# Altium project RFSoC-AMC.PrjPCB (part 20 of 22)

## Sheet FPGA_7A35T_POWER.SchDoc: RFSoC AMC
size 420 x 297 mm; CmpIndex: 0; CompanyName: WUT; DrawnBy: T. Przywozki; Organization: WUT ISE; Address1: Warsaw University of Technology; Address2: Nowowiejska 15/19 00-665 Warsaw; Address3: Tomasz.Przywozki@pw.edu.pl; DocumentNumber: 17; Revision: 1; SheetNumber: 17; SheetTotal: 45; Project: RFSoC AMC; ModifiedBy: T. Przywozki; CreateDate: -; CheckedDate: -; DivGrp: ISE; Designer: T. Przywozki; ModifiedDate: -; ProjectName: ADC/DAC MEZZANINE
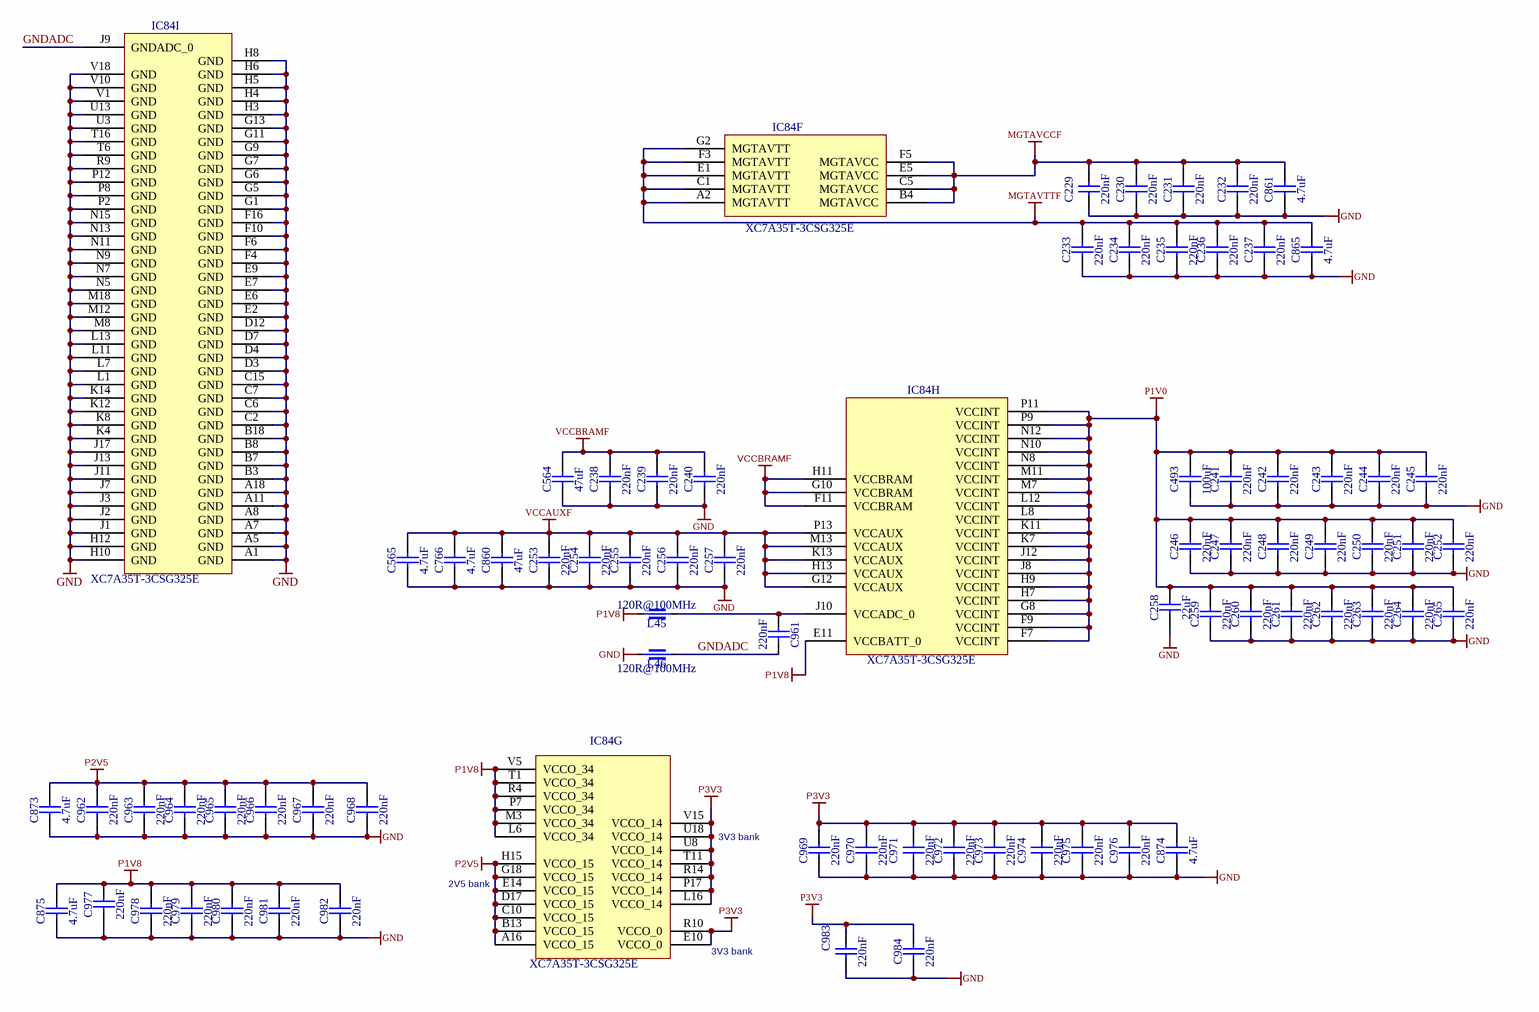
[diagram p43: FPGA_7A35T_POWER.SchDoc]

### Parts
C229  220nF  [CAPC0603X33N]
C230  220nF  [CAPC0603X33N]
C231  220nF  [CAPC0603X33N]
C232  220nF  [CAPC0603X33N]
C233  220nF  [CAPC0603X33N]
C234  220nF  [CAPC0603X33N]
C235  220nF  [CAPC0603X33N]
C236  220nF  [CAPC0603X33N]
C237  220nF  [CAPC0603X33N]
C238  220nF  [CAPC0603X33N]
C239  220nF  [CAPC0603X33N]
C240  220nF  [CAPC0603X33N]
C241  220nF  [CAPC0603X33N]
C242  220nF  [CAPC0603X33N]
C243  220nF  [CAPC0603X33N]
C244  220nF  [CAPC0603X33N]
C245  220nF  [CAPC0603X33N]
C246  220nF  [CAPC0603X33N]
C247  220nF  [CAPC0603X33N]
C248  220nF  [CAPC0603X33N]
C249  220nF  [CAPC0603X33N]
C250  220nF  [CAPC0603X33N]
C251  220nF  [CAPC0603X33N]
C252  220nF  [CAPC0603X33N]
C253  220nF  [CAPC0603X33N]
C254  220nF  [CAPC0603X33N]
C255  220nF  [CAPC0603X33N]
C256  220nF  [CAPC0603X33N]
C257  220nF  [CAPC0603X33N]
C258  22uF  [CAPC2012X135N]
C259  220nF  [CAPC0603X33N]
C260  220nF  [CAPC0603X33N]
C261  220nF  [CAPC0603X33N]
C262  220nF  [CAPC0603X33N]
C263  220nF  [CAPC0603X33N]
C264  220nF  [CAPC0603X33N]
C265  220nF  [CAPC0603X33N]
C493  100uF  [CAPC3225X270N]
C564  47uF  [CAPC1608X100N]
C565  4.7uF  [CAPC1005X55N]
C766  4.7uF  [CAPC1005X55N]
C860  47uF  [CAPC1608X100N]
C861  4.7uF  [CAPC1005X55N]
C865  4.7uF  [CAPC1005X55N]
C873  4.7uF  [CAPC1005X55N]
C874  4.7uF  [CAPC1005X55N]
C875  4.7uF  [CAPC1005X55N]
C961  220nF  [CAPC0603X33N]
C962  220nF  [CAPC0603X33N]
C963  220nF  [CAPC0603X33N]
C964  220nF  [CAPC0603X33N]
C965  220nF  [CAPC0603X33N]
C966  220nF  [CAPC0603X33N]
C967  220nF  [CAPC0603X33N]
C968  220nF  [CAPC0603X33N]
C969  220nF  [CAPC0603X33N]
C970  220nF  [CAPC0603X33N]
C971  220nF  [CAPC0603X33N]
C972  220nF  [CAPC0603X33N]
C973  220nF  [CAPC0603X33N]
C974  220nF  [CAPC0603X33N]
C975  220nF  [CAPC0603X33N]
C976  220nF  [CAPC0603X33N]
C977  220nF  [CAPC0603X33N]
C978  220nF  [CAPC0603X33N]
C979  220nF  [CAPC0603X33N]
C980  220nF  [CAPC0603X33N]
C981  220nF  [CAPC0603X33N]
C982  220nF  [CAPC0603X33N]
C983  220nF  [CAPC0603X33N]
C984  220nF  [CAPC0603X33N]
IC84  XC7A35T-3CSG325E  [CSG325]  (parts F,G,H,I of 9)
L45  120R@100MHz  [INDC1005X55N]
L46  120R@100MHz  [INDC1005X55N]

### Nets
GND: C229.1 C230.1 C231.1 C232.1 C233.1 C234.1 C235.1 C236.1 C237.1 C238.1 C239.1 C240.1 C241.1 C242.1 C243.1 C244.1 C245.1 C246.1 C247.1 C248.1 C249.1 C250.1 C251.1 C252.1 C253.1 C254.1 C255.1 C256.1 C257.1 C258.1 C259.1 C260.1 C261.1 C262.1 C263.1 C264.1 C265.1 C493.1 C564.1 C565.1 C766.1 C860.1 C861.1 C865.1 C873.1 C874.1 C875.1 C962.1 C963.1 C964.1 C965.1 C966.1 C967.1 C968.1 C969.1 C970.1 C971.1 C972.1 C973.1 C974.1 C975.1 C976.1 C977.1 C978.1 C979.1 C980.1 C981.1 C982.1 C983.1 C984.1 IC84.A1(GND) IC84.A5(GND) IC84.A7(GND) IC84.A8(GND) IC84.A11(GND) IC84.A18(GND) IC84.B3(GND) IC84.B7(GND) IC84.B8(GND) IC84.B18(GND) IC84.C2(GND) IC84.C6(GND) IC84.C7(GND) IC84.C15(GND) IC84.D3(GND) IC84.D4(GND) IC84.D7(GND) IC84.D12(GND) IC84.E2(GND) IC84.E6(GND) IC84.E7(GND) IC84.E9(GND) IC84.F4(GND) IC84.F6(GND) IC84.F10(GND) IC84.F16(GND) IC84.G1(GND) IC84.G5(GND) IC84.G6(GND) IC84.G7(GND) IC84.G9(GND) IC84.G11(GND) IC84.G13(GND) IC84.H3(GND) IC84.H4(GND) IC84.H5(GND) IC84.H6(GND) IC84.H8(GND) IC84.H10(GND) IC84.H12(GND) IC84.J1(GND) IC84.J2(GND) IC84.J3(GND) IC84.J7(GND) IC84.J11(GND) IC84.J13(GND) IC84.J17(GND) IC84.K4(GND) IC84.K8(GND) IC84.K12(GND) IC84.K14(GND) IC84.L1(GND) IC84.L7(GND) IC84.L11(GND) IC84.L13(GND) IC84.M8(GND) IC84.M12(GND) IC84.M18(GND) IC84.N5(GND) IC84.N7(GND) IC84.N9(GND) IC84.N11(GND) IC84.N13(GND) IC84.N15(GND) IC84.P2(GND) IC84.P8(GND) IC84.P12(GND) IC84.R9(GND) IC84.T6(GND) IC84.T16(GND) IC84.U3(GND) IC84.U13(GND) IC84.V1(GND) IC84.V10(GND) IC84.V18(GND) L46.1
MGTAVCCF: C229.2 C230.2 C231.2 C232.2 C861.2 IC84.B4(MGTAVCC) IC84.C5(MGTAVCC) IC84.E5(MGTAVCC) IC84.F5(MGTAVCC)
MGTAVTTF: C233.2 C234.2 C235.2 C236.2 C237.2 C865.2 IC84.A2(MGTAVTT) IC84.C1(MGTAVTT) IC84.E1(MGTAVTT) IC84.F3(MGTAVTT) IC84.G2(MGTAVTT)
P1V0: C241.2 C242.2 C243.2 C244.2 C245.2 C246.2 C247.2 C248.2 C249.2 C250.2 C251.2 C252.2 C258.2 C259.2 C260.2 C261.2 C262.2 C263.2 C264.2 C265.2 C493.2 IC84.F7(VCCINT) IC84.F9(VCCINT) IC84.G8(VCCINT) IC84.H7(VCCINT) IC84.H9(VCCINT) IC84.J8(VCCINT) IC84.J12(VCCINT) IC84.K7(VCCINT) IC84.K11(VCCINT) IC84.L8(VCCINT) IC84.L12(VCCINT) IC84.M7(VCCINT) IC84.M11(VCCINT) IC84.N8(VCCINT) IC84.N10(VCCINT) IC84.N12(VCCINT) IC84.P9(VCCINT) IC84.P11(VCCINT)
P1V8: C875.2 C977.2 C978.2 C979.2 C980.2 C981.2 C982.2 IC84.E11(VCCBATT_0) IC84.L6(VCCO_34) IC84.M3(VCCO_34) IC84.P7(VCCO_34) IC84.R4(VCCO_34) IC84.T1(VCCO_34) IC84.V5(VCCO_34) L45.1
P2V5: C873.2 C962.2 C963.2 C964.2 C965.2 C966.2 C967.2 C968.2 IC84.A16(VCCO_15) IC84.B13(VCCO_15) IC84.C10(VCCO_15) IC84.D17(VCCO_15) IC84.E14(VCCO_15) IC84.G18(VCCO_15) IC84.H15(VCCO_15)
P3V3: C874.2 C969.2 C970.2 C971.2 C972.2 C973.2 C974.2 C975.2 C976.2 C983.2 C984.2 IC84.E10(VCCO_0) IC84.L16(VCCO_14) IC84.P17(VCCO_14) IC84.R10(VCCO_0) IC84.R14(VCCO_14) IC84.T11(VCCO_14) IC84.U8(VCCO_14) IC84.U18(VCCO_14) IC84.V15(VCCO_14)
VCCAUXF: C253.2 C254.2 C255.2 C256.2 C257.2 C565.2 C766.2 C860.2 IC84.G12(VCCAUX) IC84.H13(VCCAUX) IC84.K13(VCCAUX) IC84.M13(VCCAUX) IC84.P13(VCCAUX)
VCCBRAMF: C238.2 C239.2 C240.2 C564.2 IC84.F11(VCCBRAM) IC84.G10(VCCBRAM) IC84.H11(VCCBRAM)
GNDADC: C961.2 IC84.J9(GNDADC_0) L46.2
NetC961_1: C961.1 IC84.J10(VCCADC_0) L45.2

### Notes on the sheet
- 3V3 bank
- (near IC84) 2V5 bank
- (near IC84) 3V3 bank
- Project/Equipment
- Document
- Designer
- Drawn by
- Check.by
- Copyright WUT ISE 2021
  This documentation describes Open Hardware and is licensed under CERN OHL v.1.1. You may redistribute and modify this documentaction under the terms of the CERN OHL v1.1.
  (http://ohwr.org/CERNOHL). This documentation is dristributed WITHOUT ANY EXPRESS OR IMPLIED WARRANTY, INCLUDING OF MERCHANTABLITY, SATISFACTORY QUALITY AND FITNESS FOR A PARTICULAR PURPOSE. Please see the CERN OHL v.1.1 for applicable conditions
- File
- Last Mod.
- Print Date
- Sheet
- Size
- A3
- of
- Rev
- Contact:

### Library data of the parts
C229-C257 C259-C265 C961-C984 = CC0201_220NF_6.3V_20%_X5R: Non-polarised capacitor; Manufacturer: GENERIC; Manufacturer1 Part Number: JMK063BJ224MP-F; Part Description: SMD Multilayer Chip Ceramic Capacitor; TC: X5R; Tolerance: ±20%; Voltage: 6.3V; Case: 0201; Manufacturer Part Number: CC0201_220NF_6.3V_20%_X5R; Manufacturer1 Example: TAIYO YUDEN; Part Number: CC0201_220NF_6.3V_20%_X5R; Pin Count: 2; SMD: Yes; Status: Not Recommended; Value: 220nF; Component Kind: Standard; Component Type: Standard; Mounted: Yes; Socket: No; Sense: No; Manufacturer1 ComponentHeight: 0.33mm; HelpURL: \\cern.ch\dfs\Applications\Altium\Datasheets\CC0201_X5R_TAIYO-YUDEN_STANDARD-CLASS2.pdf; Author: CERN DEM JLC; CreateDate: 27.05.2010; LatestRevisionDate: 27.05.2010
C258 = CC0805_22UF_6.3V_20%_X5R: Non-polarised capacitor; Manufacturer: GENERIC; Manufacturer1 Part Number: C0805C226M9PAC7800; Part Description: SMD Multilayer Chip Ceramic Capacitor; TC: X5R; Tolerance: ±20%; Voltage: 6.3V; Case: 0805; Manufacturer Part Number: CC0805_22UF_6.3V_20%_X5R; Manufacturer1 Example: KEMET; Part Number: CC0805_22UF_6.3V_20%_X5R; Pin Count: 2; SMD: Yes; Status: Preferred; Value: 22uF; Component Kind: Standard; Component Type: Standard; Mounted: Yes; Socket: No; Sense: No; Manufacturer1 ComponentHeight: 1.45mm; HelpURL: \\cern.ch\dfs\Applications\Altium\Datasheets\CC1206_X5R_KEMET.pdf; Author: CERN DEM JLC; CreateDate: 03.12.2007; LatestRevisionDate: 03.12.2007
C493 = CC1210_100UF_6.3V_20%_X5R: Non-polarised capacitor; Part Description: SMD Multilayer Chip Ceramic Capacitor; Manufacturer: GENERIC; Manufacturer1 Part Number: GRM32ER60J107ME20L; Voltage: 6.3V; Tolerance: ±20%; TC: X5R; Part Number: CC1210_100UF_6.3V_20%_X5R; Component Kind: Standard; Component Type: Standard; Pin Count: 2; Value: 100uF; Status: Preferred; Manufacturer Part Number: CC1210_100UF_6.3V_20%_X5R; Case: 1210; Mounted: Yes; Socket: No; SMD: Yes; Sense: No; Manufacturer1 Example: MURATA; Manufacturer1 ComponentHeight: 2.7mm; HelpURL: \\cern.ch\dfs\Applications\Altium\Datasheets\CC1210_X5R_MURATA.pdf; Author: CERN DEM JLC; CreateDate: 19.04.2010; LatestRevisionDate: 19.04.2010
C564 C860 = CC0603_47UF_6.3V_20%_X5R: Non-polarised capacitor; Part Description: SMD Multilayer Chip Ceramic Capacitor; Manufacturer: GENERIC; Manufacturer1 Part Number: GRM188R60J476ME15D; Voltage: 6.3V; Tolerance: ±20%; TC: X5R; Part Number: CC0603_47UF_6.3V_20%_X5R; Component Kind: Standard; Component Type: Standard; Pin Count: 2; Value: 47uF; Status: None; Manufacturer Part Number: CC0603_47UF_6.3V_20%_X5R; Case: 0603; Mounted: Yes; Socket: No; SMD: Yes; Sense: No; Manufacturer1 Example: MURATA; Manufacturer1 ComponentHeight: 1mm; HelpURL: \\cern.ch\dfs\Applications\Altium\Datasheets\CC0603_MURATA_GRM188R60J476ME15D.pdf; Author: CERN DEM JLC; CreateDate: 01.02.2018; LatestRevisionDate: 01.02.2018
C565 C766 C861 C865 C873-C875 = CC0402_4.7UF_6.3V_20%_X5R: Non-polarised capacitor; Part Description: SMD Multilayer Chip Ceramic Capacitor; Manufacturer: GENERIC; Manufacturer1 Part Number: C1005X5R0J475M050BC; Voltage: 6.3V; Tolerance: ±20%; TC: X5R; Part Number: CC0402_4.7UF_6.3V_20%_X5R; Component Kind: Standard; Component Type: Standard; Pin Count: 2; Value: 4.7uF; Status: Preferred; Manufacturer Part Number: CC0402_4.7UF_6.3V_20%_X5R; Case: 0402; Mounted: Yes; Socket: No; SMD: Yes; Sense: No; Manufacturer1 Example: TDK; Manufacturer1 ComponentHeight: 0.65mm; HelpURL: \\cern.ch\dfs\Applications\Altium\Datasheets\CC0402_X5R_TDK_C.pdf; Author: CERN DEM JLC; CreateDate: 03.03.2015; LatestRevisionDate: 03.03.2015
IC84 = CMP-0383-00015-1: Artix-7 FPGA, 150 User I/Os, 4 GTP, 324-Ball BGA, Speed Grade 3, Extended Grade, Pb-Free; Manufacturer: Xilinx; CMTs: 5; Available User I/O: 150; GTP: 4; Speed Grades: 3; Total Block RAM: 1800 Kb; Logic Cells: 33280; ComponentLink3URL: http://www.xilinx.com/support/documentation/user_guides/ug475_7Series_Pkg_Pinout.pdf; ComponentLink3Description: Pinout; Operating Temperature Range: Extended; PackageReference: CSG-325; PackageDescription: 324-Ball Wire-Bond Chip-Scale BGA, Body 15 x 15 mm, Pitch 0.8 mm; ComponentLink4URL: http://www.xilinx.com/support/documentation/user_guides/ug475_7Series_Pkg_Pinout.pdf; ComponentLink1Description: Manufacturer URL; ComponentLink2Description: Datasheet; DatasheetVersion: Rev. 1.15; PartNumber: XC7A35T-3CSG325E; Mounting Technology: Surface Mount; ComponentLink1URL: http://www.xilinx.com/; PackageVersion: Rev. 1.11; ComponentLink2URL: http://www.xilinx.com/support/documentation/data_sheets/ds180_7Series_Overview.pdf; Maximum Distributed RAM: 400 Kb; ComponentLink4Description: Package Specification
L45 L46 = IND0402_MURATA_BLM15PX121SN1D: Manufacturer: MURATA; Part Description: SMD EMIFIL Chip Ferrite Bead; Power: 2A; Resistance: 0.055R; Tolerance: ±25%; Case: 0402; ComponentHeight: 0.55mm; Manufacturer Part Number: BLM15PX121SN1D; Part Number: IND0402_MURATA_BLM15PX121SN1D; Pin Count: 2; SMD: Yes; Value: 120R@100MHz; Component Kind: Standard; Component Type: Standard; Status: None; Mounted: Yes; Socket: No; Sense: No; HelpURL: \\cern.ch\dfs\Applications\Altium\Datasheets\IND0402_MURATA_BLM15PX.pdf; Author: CERN DEM JMW; CreateDate: 19.02.2014; LatestRevisionDate: 25.10.2018

## Sheet SoC_Decoupling.SchDoc: RFSoC AMC
size 420 x 297 mm; CompanyName: WUT; DrawnBy: T. Przywozki; Organization: WUT ISE; Address1: Warsaw University of Technology; Address2: Nowowiejska 15/19 00-665 Warsaw; Address3: Tomasz.Przywozki@pw.edu.pl; DocumentNumber: 42; Revision: 1; SheetNumber: 42; SheetTotal: 45; Project: RFSoC AMC; ModifiedBy: T. Przywozki; CreateDate: -; CheckedDate: -; DivGrp: ISE; Designer: T. Przywozki; ModifiedDate: -; ProjectName: ADC/DAC MEZZANINE
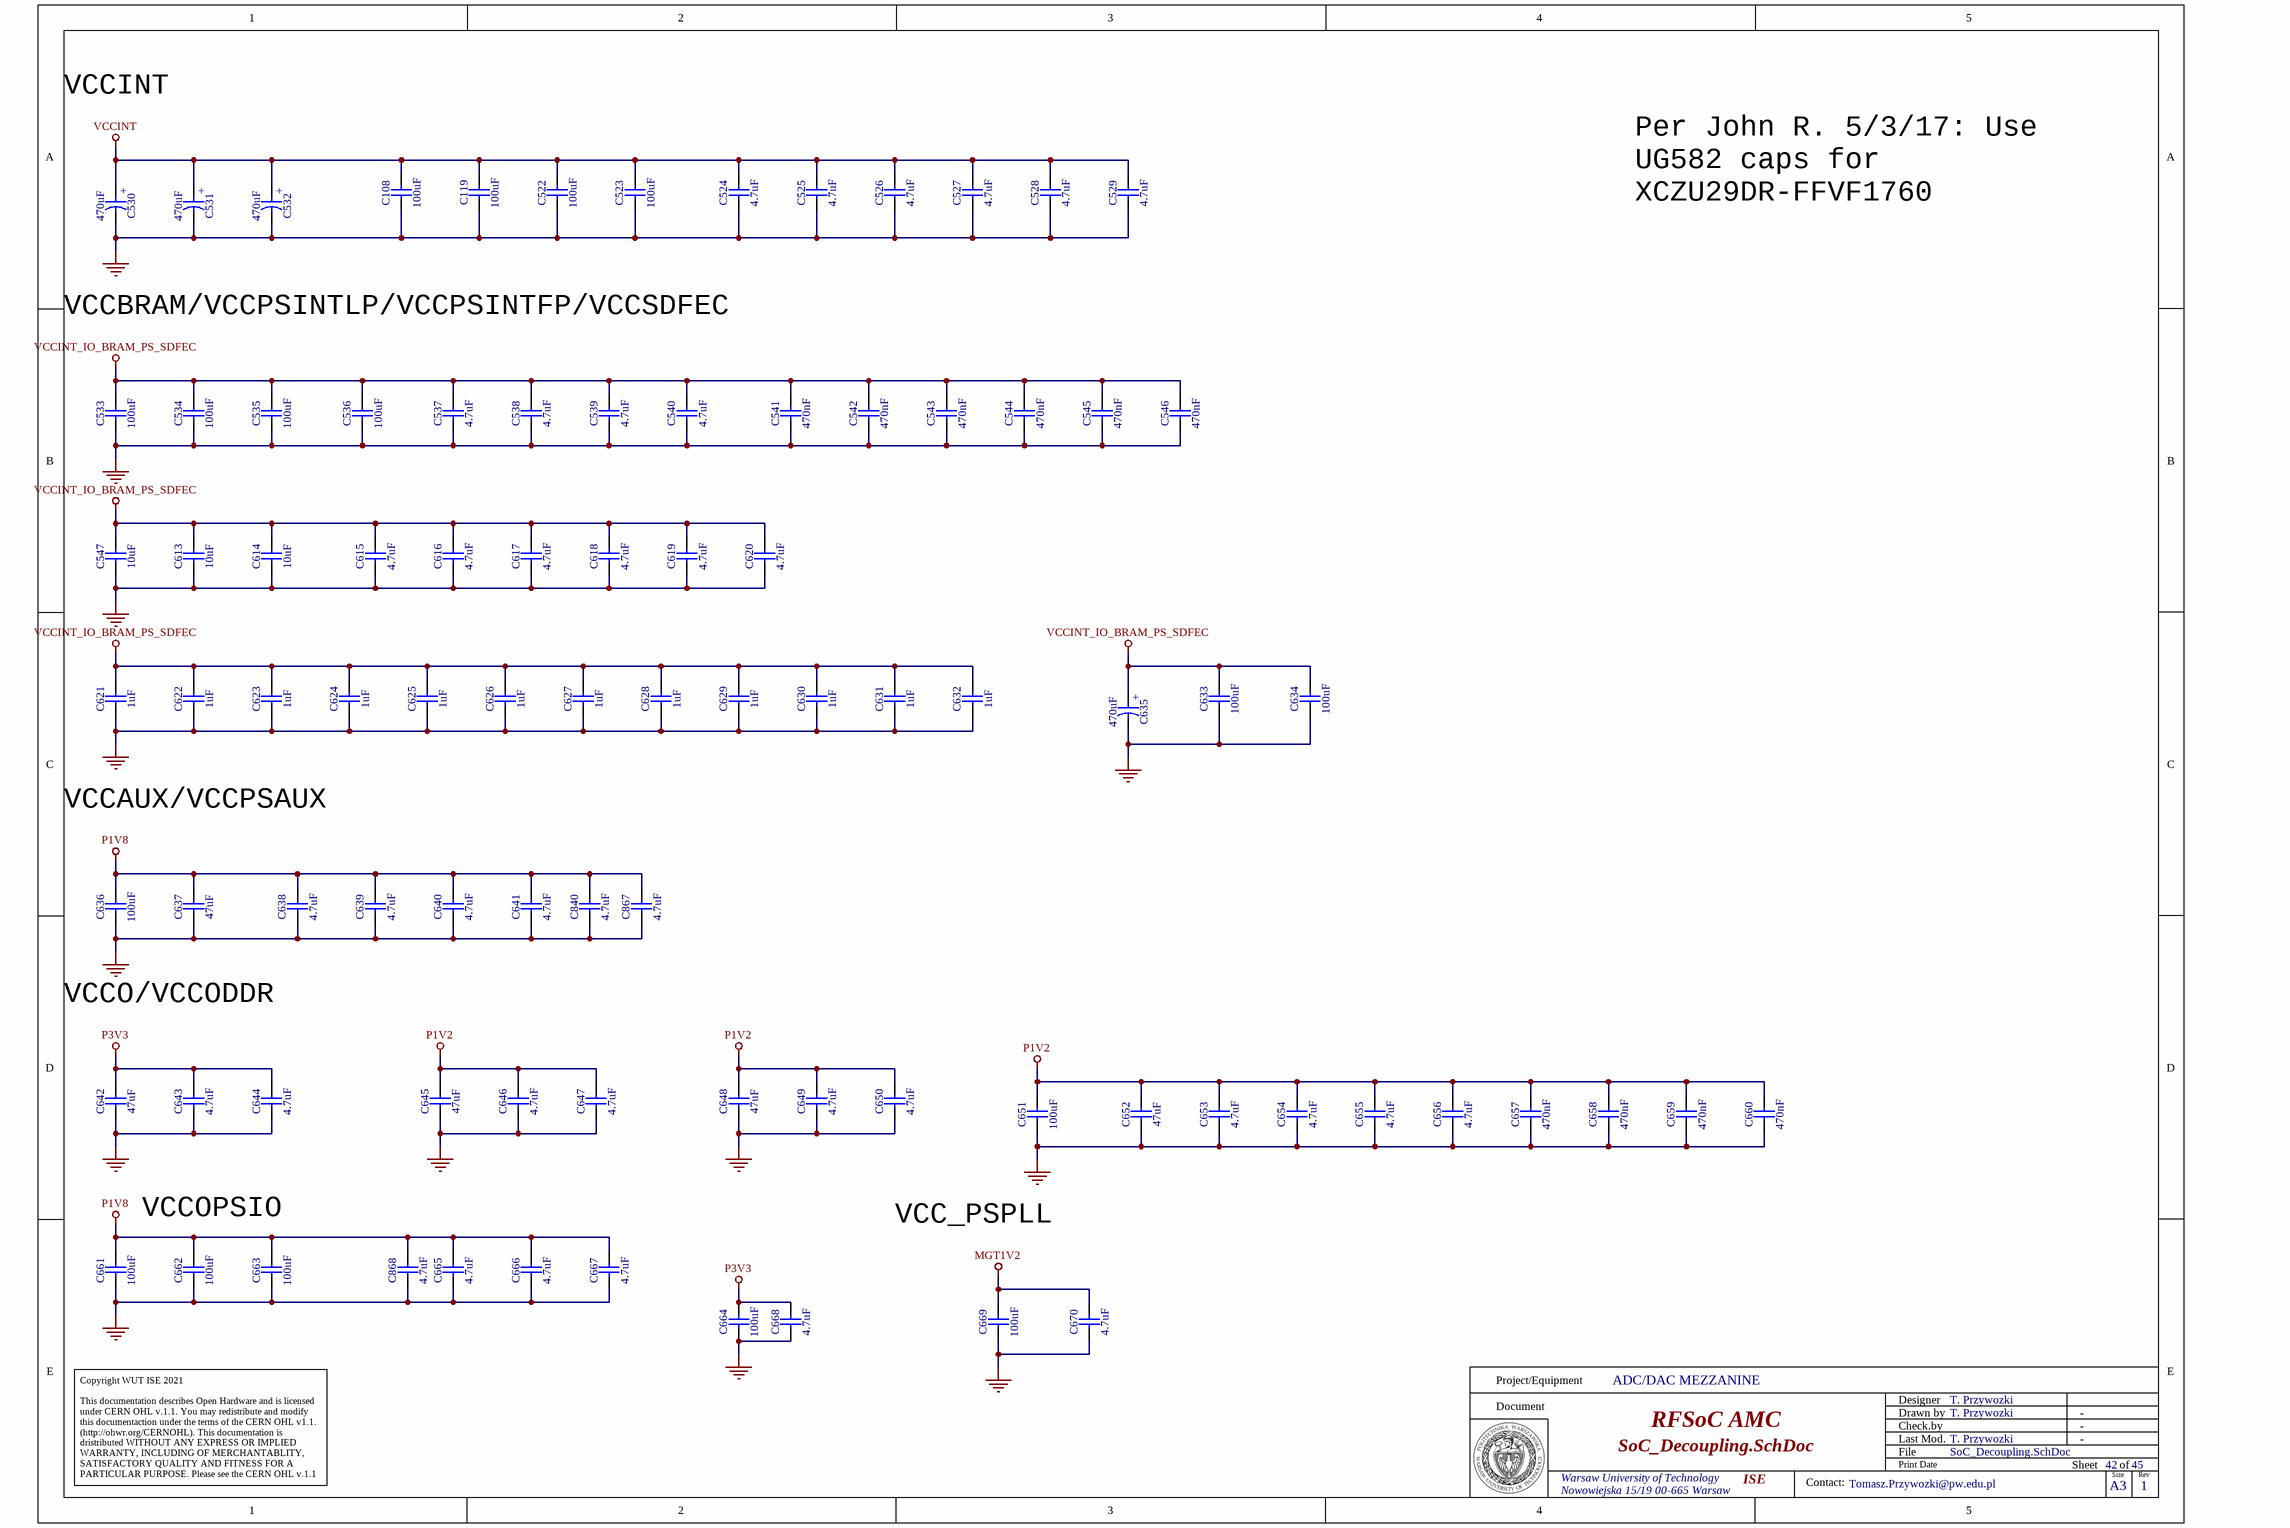
[diagram p44: SoC_Decoupling.SchDoc]

### Parts
C108  100uF  [CAPC3216X180N]
C119  100uF  [CAPC3216X180N]
C522  100uF  [CAPC3216X180N]
C523  100uF  [CAPC3216X180N]
C524  4.7uF  [CAPC1005X55N]
C525  4.7uF  [CAPC1005X55N]
C526  4.7uF  [CAPC1005X55N]
C527  4.7uF  [CAPC1005X55N]
C528  4.7uF  [CAPC1005X55N]
C529  4.7uF  [CAPC1005X55N]
C530  470uF  [CAPMP7343X200N]
C531  470uF  [CAPMP7343X200N]
C532  470uF  [CAPMP7343X200N]
C533  100uF  [CAPC3225X270N]
C534  100uF  [CAPC3225X270N]
C535  100uF  [CAPC3225X270N]
C536  100uF  [CAPC3225X270N]
C537  4.7uF  [CAPC1005X55N]
C538  4.7uF  [CAPC1005X55N]
C539  4.7uF  [CAPC1005X55N]
C540  4.7uF  [CAPC1005X55N]
C541  470nF  [CAPC1005X55N]
C542  470nF  [CAPC1005X55N]
C543  470nF  [CAPC1005X55N]
C544  470nF  [CAPC1005X55N]
C545  470nF  [CAPC1005X55N]
C546  470nF  [CAPC1005X55N]
C547  10uF  [CAPC1608X80N]
C613  10uF  [CAPC1608X80N]
C614  10uF  [CAPC1608X80N]
C615  4.7uF  [CAPC1005X55N]
C616  4.7uF  [CAPC1005X55N]
C617  4.7uF  [CAPC1005X55N]
C618  4.7uF  [CAPC1005X55N]
C619  4.7uF  [CAPC1005X55N]
C620  4.7uF  [CAPC1005X55N]
C621  1uF  [CAPC1005X55N]
C622  1uF  [CAPC1005X55N]
C623  1uF  [CAPC1005X55N]
C624  1uF  [CAPC1005X55N]
C625  1uF  [CAPC1005X55N]
C626  1uF  [CAPC1005X55N]
C627  1uF  [CAPC1005X55N]
C628  1uF  [CAPC1005X55N]
C629  1uF  [CAPC1005X55N]
C630  1uF  [CAPC1005X55N]
C631  1uF  [CAPC1005X55N]
C632  1uF  [CAPC1005X55N]
C633  100uF  [CAPC3225X270N]
C634  100uF  [CAPC3225X270N]
C635  470uF  [CAPMP7343X200N]
C636  100uF  [CAPC3225X270N]
C637  47uF  [CAPC1608X100N]
C638  4.7uF  [CAPC1005X55N]
C639  4.7uF  [CAPC1005X55N]
C640  4.7uF  [CAPC1005X55N]
C641  4.7uF  [CAPC1005X55N]
C642  47uF  [CAPC1608X100N]
C643  4.7uF  [CAPC1005X55N]
C644  4.7uF  [CAPC1005X55N]
C645  47uF  [CAPC1608X100N]
C646  4.7uF  [CAPC1005X55N]
C647  4.7uF  [CAPC1005X55N]
C648  47uF  [CAPC1608X100N]
C649  4.7uF  [CAPC1005X55N]
C650  4.7uF  [CAPC1005X55N]
C651  100uF  [CAPC3225X270N]
C652  47uF  [CAPC1608X100N]
C653  4.7uF  [CAPC1005X55N]
C654  4.7uF  [CAPC1005X55N]
C655  4.7uF  [CAPC1005X55N]
C656  4.7uF  [CAPC1005X55N]
C657  470nF  [CAPC1005X55N]
C658  470nF  [CAPC1005X55N]
C659  470nF  [CAPC1005X55N]
C660  470nF  [CAPC1005X55N]
C661  100uF  [CAPC3225X270N]
C662  100uF  [CAPC3225X270N]
C663  100uF  [CAPC3225X270N]
C664  100uF  [CAPC3225X270N]
C665  4.7uF  [CAPC1005X55N]
C666  4.7uF  [CAPC1005X55N]
C667  4.7uF  [CAPC1005X55N]
C668  4.7uF  [CAPC1005X55N]
C669  100uF  [CAPC3216X180N]
C670  4.7uF  [CAPC1005X55N]
C840  4.7uF  [CAPC1005X55N]
C867  4.7uF  [CAPC1005X55N]
C868  4.7uF  [CAPC1005X55N]

### Nets
GND: C108.1 C119.1 C522.1 C523.1 C524.1 C525.1 C526.1 C527.1 C528.1 C529.1 C530.2 C531.2 C532.2 C533.1 C534.1 C535.1 C536.1 C537.1 C538.1 C539.1 C540.1 C541.1 C542.1 C543.1 C544.1 C545.1 C546.1 C547.1 C613.1 C614.1 C615.1 C616.1 C617.1 C618.1 C619.1 C620.1 C621.1 C622.1 C623.1 C624.1 C625.1 C626.1 C627.1 C628.1 C629.1 C630.1 C631.1 C632.1 C633.1 C634.1 C635.2 C636.1 C637.1 C638.1 C639.1 C640.1 C641.1 C642.1 C643.1 C644.1 C645.1 C646.1 C647.1 C648.1 C649.1 C650.1 C651.1 C652.1 C653.1 C654.1 C655.1 C656.1 C657.1 C658.1 C659.1 C660.1 C661.1 C662.1 C663.1 C664.1 C665.1 C666.1 C667.1 C668.1 C669.1 C670.1 C840.1 C867.1 C868.1
MGT1V2: C669.2 C670.2
P1V2: C645.2 C646.2 C647.2 C648.2 C649.2 C650.2 C651.2 C652.2 C653.2 C654.2 C655.2 C656.2 C657.2 C658.2 C659.2 C660.2
P1V8: C636.2 C637.2 C638.2 C639.2 C640.2 C641.2 C661.2 C662.2 C663.2 C665.2 C666.2 C667.2 C840.2 C867.2 C868.2
P3V3: C642.2 C643.2 C644.2 C664.2 C668.2
VCCINT: C108.2 C119.2 C522.2 C523.2 C524.2 C525.2 C526.2 C527.2 C528.2 C529.2 C530.1 C531.1 C532.1
VCCINT_IO_BRAM_PS_SDFEC: C533.2 C534.2 C535.2 C536.2 C537.2 C538.2 C539.2 C540.2 C541.2 C542.2 C543.2 C544.2 C545.2 C546.2 C547.2 C613.2 C614.2 C615.2 C616.2 C617.2 C618.2 C619.2 C620.2 C621.2 C622.2 C623.2 C624.2 C625.2 C626.2 C627.2 C628.2 C629.2 C630.2 C631.2 C632.2 C633.2 C634.2 C635.1

### Notes on the sheet
- VCCINT
- Per John R. 5/3/17: Use
  UG582 caps for
  XCZU29DR-FFVF1760
- VCCBRAM/VCCPSINTLP/VCCPSINTFP/VCCSDFEC
- VCCAUX/VCCPSAUX
- VCCO/VCCODDR
- VCCOPSIO
- VCC_PSPLL
- Project/Equipment
- Document
- Designer
- Drawn by
- Check.by
- Copyright WUT ISE 2021
  This documentation describes Open Hardware and is licensed under CERN OHL v.1.1. You may redistribute and modify this documentaction under the terms of the CERN OHL v1.1.
  (http://ohwr.org/CERNOHL). This documentation is dristributed WITHOUT ANY EXPRESS OR IMPLIED WARRANTY, INCLUDING OF MERCHANTABLITY, SATISFACTORY QUALITY AND FITNESS FOR A PARTICULAR PURPOSE. Please see the CERN OHL v.1.1 for applicable conditions
- File
- Last Mod.
- Print Date
- Sheet
- Size
- A3
- of
- Rev
- Contact:
- (in symbol CAEM7343-20_470UF_2V_20%_LESR0003_PANASONIC_EEFGX0D471R) +

### Library data of the parts
C108 C119 C522 C523 C669 = CC1206_100UF_6.3V_20%_X5R: Non-polarised capacitor; Part Description: SMD Multilayer Chip Ceramic Capacitor; Manufacturer: GENERIC; Manufacturer1 Part Number: C1206C107M9PACTU; Voltage: 6.3V; Tolerance: ±10%; TC: X5R; Part Number: CC1206_100UF_6.3V_20%_X5R; Component Kind: Standard; Component Type: Standard; Pin Count: 2; Value: 100uF; Status: None; Manufacturer Part Number: CC1206_100UF_6.3V_20%_X5R; Case: 1206; Mounted: Yes; Socket: No; SMD: Yes; Sense: No; Manufacturer1 Example: KEMET; Manufacturer1 ComponentHeight: 1.8mm; HelpURL: \\cern.ch\dfs\Applications\Altium\Datasheets\CC1206_X5R_KEMET.pdf; Author: CERN DEM JLC; CreateDate: 26.09.2012; LatestRevisionDate: 26.09.2012
C524-C529 C537-C540 C615-C620 C638-C641 C643 C644 C646 C647 C649 C650 C653-C656 C665-C668 C670 C840 C867 C868 = CC0402_4.7UF_6.3V_20%_X5R: as C565 on sheet FPGA_7A35T_POWER; Part Number: CC0402_4.7UF_6.3V_20%_X5R; Component Kind: Standard; Component Type: Standard; Pin Count: 2; Value: 4.7uF; Status: Preferred; Manufacturer Part Number: CC0402_4.7UF_6.3V_20%_X5R; Case: 0402; Mounted: Yes; Socket: No; SMD: Yes; Sense: No; Manufacturer1 Example: TDK; Manufacturer1 ComponentHeight: 0.65mm; HelpURL: \\cern.ch\dfs\Applications\Altium\Datasheets\CC0402_X5R_TDK_C.pdf; Author: CERN DEM JLC; CreateDate: 03.03.2015; LatestRevisionDate: 03.03.2015
C530-C532 C635 = CAEM7343-20_470UF_2V_20%_LESR0003_PANASONIC_EEFGX0D471R: Polarised capacitor; Part Description: ESR 0R003 Polymer Aluminum Electrolytic Capacitor; Voltage: 2V; Tolerance: ±20%; Part Number: CAEM7343-20_470UF_2V_20%_LESR0003_PANASONIC_EEFGX0D471R; Component Kind: Standard; Component Type: Standard; Pin Count: 2; Value: 470uF; Status: None; Manufacturer: PANASONIC; Manufacturer Part Number: EEFGX0D471R; Mounted: Yes; Socket: No; SMD: Yes; Sense: No; ComponentHeight: 2mm; HelpURL: \\cern.ch\dfs\Applications\Altium\Datasheets\CAEM_PANASONIC_EEFGX.pdf; Author: CERN DEM MR; CreateDate: 26.05.2016; LatestRevisionDate: 14.03.2017
C533-C536 C633 C634 C636 C651 C661-C664 = CC1210_100UF_6.3V_20%_X5R: as C493 on sheet FPGA_7A35T_POWER; Part Number: CC1210_100UF_6.3V_20%_X5R; Component Kind: Standard; Component Type: Standard; Pin Count: 2; Value: 100uF; Status: Preferred; Manufacturer Part Number: CC1210_100UF_6.3V_20%_X5R; Case: 1210; Mounted: Yes; Socket: No; SMD: Yes; Sense: No; Manufacturer1 Example: MURATA; Manufacturer1 ComponentHeight: 2.7mm; HelpURL: \\cern.ch\dfs\Applications\Altium\Datasheets\CC1210_X5R_MURATA.pdf; Author: CERN DEM JLC; CreateDate: 19.04.2010; LatestRevisionDate: 19.04.2010
C541-C546 C657-C660 = CC0402_470NF_16V_10%_X5R: Non-polarised capacitor; Part Description: SMD Multilayer Chip Ceramic Capacitor; Manufacturer: GENERIC; Manufacturer1 Part Number: C1005X5R1C105KT; Voltage: 16V; Tolerance: ±10%; TC: X5R; Part Number: CC0402_470NF_16V_10%_X5R; Component Kind: Standard; Component Type: Standard; Pin Count: 2; Value: 470nF; Status: Preferred; Manufacturer Part Number: CC0402_470NF_16V_10%_X5R; Case: 0402; Mounted: Yes; Socket: No; SMD: Yes; Sense: No; Manufacturer1 Example: TDK; Manufacturer1 ComponentHeight: 0.55mm; HelpURL: \\cern.ch\dfs\Applications\Altium\Datasheets\CC0402_X5R_TDK_C.pdf; Author: CERN DEM JLC; CreateDate: 25.10.2012; LatestRevisionDate: 25.10.2012
C547 C613 C614 = CC0603_10UF_10V_10%_X5R: Non-polarised capacitor; Part Description: SMD Multilayer Chip Ceramic Capacitor; Manufacturer: GENERIC; Manufacturer1 Part Number: GRM188R61A106KE69D; Voltage: 10V; Tolerance: ±10%; TC: X5R; Part Number: CC0603_10UF_10V_10%_X5R; Component Kind: Standard; Component Type: Standard; Pin Count: 2; Value: 10uF; Status: None; Manufacturer Part Number: CC0603_10UF_10V_10%_X5R; Case: 0603; Mounted: Yes; Socket: No; SMD: Yes; Sense: No; Manufacturer1 Example: MURATA; Manufacturer1 ComponentHeight: 0.8mm; HelpURL: \\cern.ch\dfs\Applications\Altium\Datasheets\CC0603_MURATA_GRM188R61A106KE69D.pdf; Author: CERN DEM JLC; CreateDate: 31.01.2017; LatestRevisionDate: 31.01.2017
C621-C632 = CC0402_1UF_16V_10%_X5R: Non-polarised capacitor; Part Description: SMD Multilayer Chip Ceramic Capacitor; Manufacturer: GENERIC; Manufacturer1 Part Number: C1005X5R1C105KT; Voltage: 16V; Tolerance: ±10%; TC: X5R; Part Number: CC0402_1UF_16V_10%_X5R; Component Kind: Standard; Component Type: Standard; Pin Count: 2; Value: 1uF; Status: Preferred; Manufacturer Part Number: CC0402_1UF_16V_10%_X5R; Case: 0402; Mounted: Yes; Socket: No; SMD: Yes; Sense: No; Manufacturer1 Example: TDK; Manufacturer1 ComponentHeight: 0.55mm; HelpURL: \\cern.ch\dfs\Applications\Altium\Datasheets\CC0402_X5R_TDK_C.pdf; Author: CERN DEM JLC; CreateDate: 25.10.2012; LatestRevisionDate: 25.10.2012
C637 C642 C645 C648 C652 = CC0603_47UF_6.3V_20%_X5R: as C564 on sheet FPGA_7A35T_POWER; Part Number: CC0603_47UF_6.3V_20%_X5R; Component Kind: Standard; Component Type: Standard; Pin Count: 2; Value: 47uF; Status: None; Manufacturer Part Number: CC0603_47UF_6.3V_20%_X5R; Case: 0603; Mounted: Yes; Socket: No; SMD: Yes; Sense: No; Manufacturer1 Example: MURATA; Manufacturer1 ComponentHeight: 1mm; HelpURL: \\cern.ch\dfs\Applications\Altium\Datasheets\CC0603_MURATA_GRM188R60J476ME15D.pdf; Author: CERN DEM JLC; CreateDate: 01.02.2018; LatestRevisionDate: 01.02.2018

## Sheet SoC_Decoupling_2.SchDoc: RFSoC AMC
size 420 x 297 mm; CompanyName: WUT; DrawnBy: T. Przywozki; Organization: WUT ISE; Address1: Warsaw University of Technology; Address2: Nowowiejska 15/19 00-665 Warsaw; Address3: Tomasz.Przywozki@pw.edu.pl; DocumentNumber: 41; Revision: 1; SheetNumber: 41; SheetTotal: 45; Project: RFSoC AMC; ModifiedBy: T. Przywozki; CreateDate: -; CheckedDate: -; DivGrp: ISE; Designer: T. Przywozki; ModifiedDate: -; ProjectName: ADC/DAC MEZZANINE
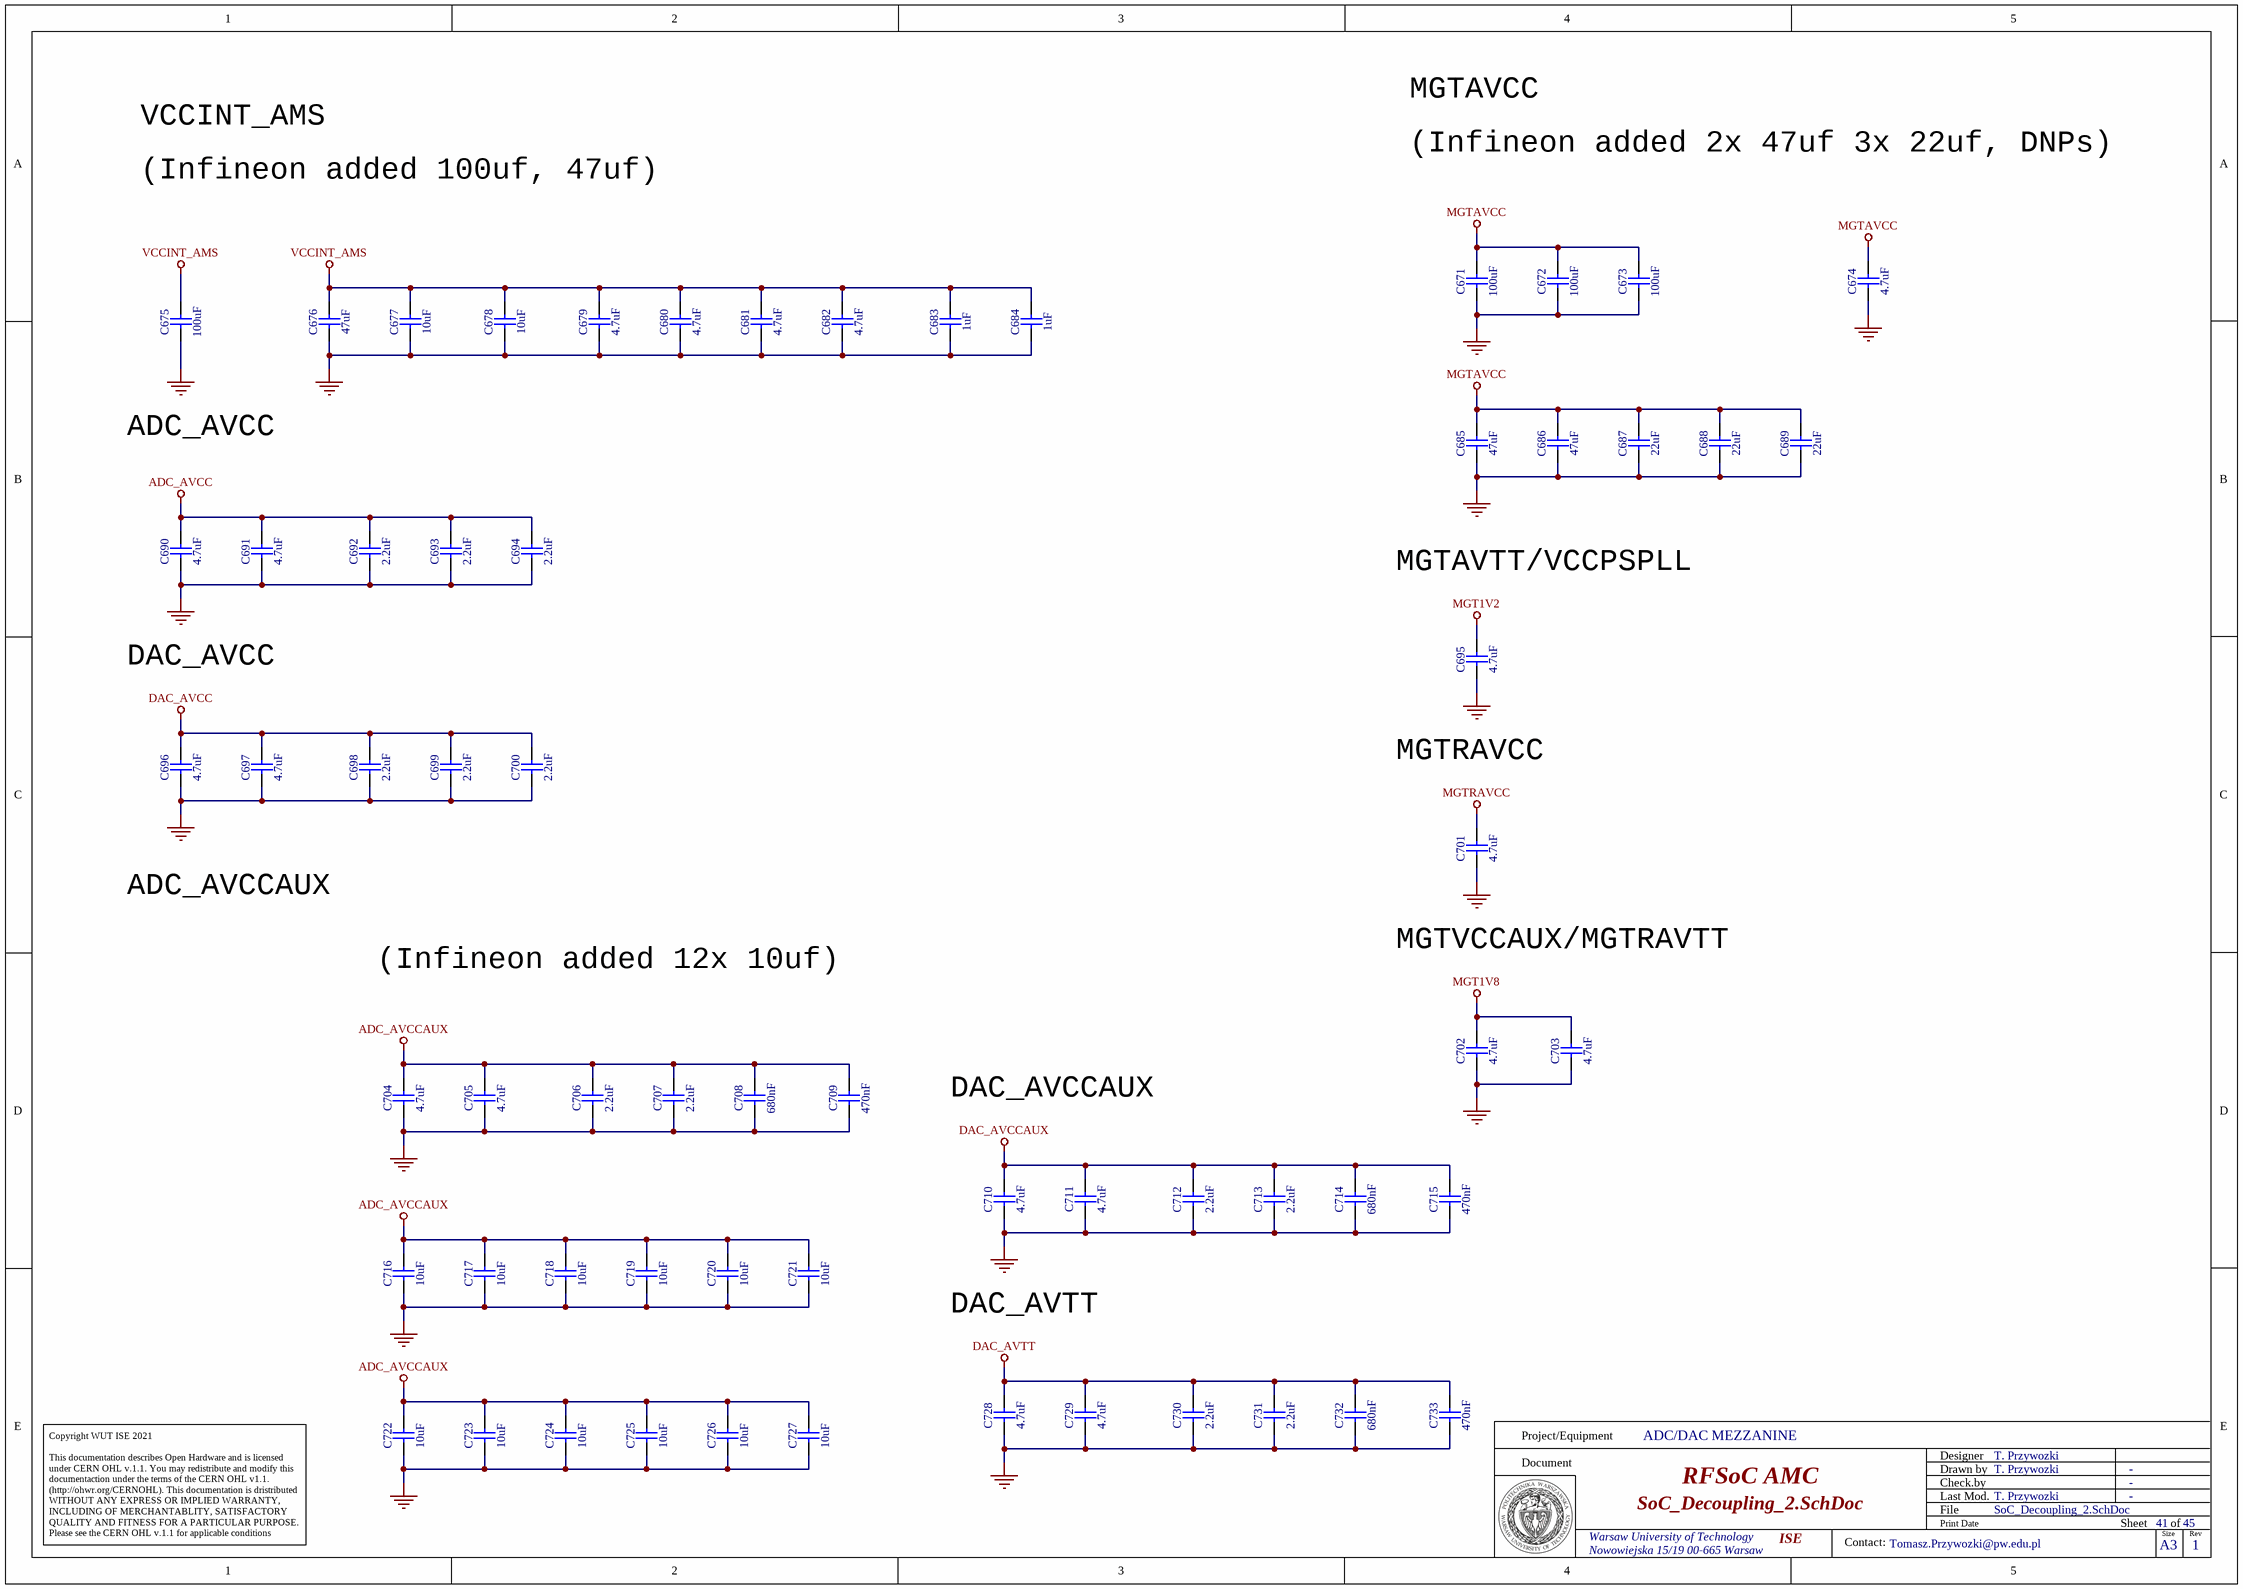
[diagram p45: SoC_Decoupling_2.SchDoc]

### Parts
C671  100uF  [CAPC3225X270N]
C672  100uF  [CAPC3225X270N]
C673  100uF  [CAPC3225X270N]
C674  4.7uF  [CAPC1005X55N]
C675  100uF  [CAPC3225X270N]
C676  47uF  [CAPC1608X100N]
C677  10uF  [CAPC1608X80N]
C678  10uF  [CAPC1608X80N]
C679  4.7uF  [CAPC1005X55N]
C680  4.7uF  [CAPC1005X55N]
C681  4.7uF  [CAPC1005X55N]
C682  4.7uF  [CAPC1005X55N]
C683  1uF  [CAPC1005X55N]
C684  1uF  [CAPC1005X55N]
C685  47uF  [CAPC1608X100N]
C686  47uF  [CAPC1608X100N]
C687  22uF  [CAPC3225X270N]
C688  22uF  [CAPC3225X270N]
C689  22uF  [CAPC3225X270N]
C690  4.7uF  [CAPC1005X55N]
C691  4.7uF  [CAPC1005X55N]
C692  2.2uF  [CAPC1005X55N]
C693  2.2uF  [CAPC1005X55N]
C694  2.2uF  [CAPC1005X55N]
C695  4.7uF  [CAPC1005X55N]
C696  4.7uF  [CAPC1005X55N]
C697  4.7uF  [CAPC1005X55N]
C698  2.2uF  [CAPC1005X55N]
C699  2.2uF  [CAPC1005X55N]
C700  2.2uF  [CAPC1005X55N]
C701  4.7uF  [CAPC1005X55N]
C702  4.7uF  [CAPC1005X55N]
C703  4.7uF  [CAPC1005X55N]
C704  4.7uF  [CAPC1005X55N]
C705  4.7uF  [CAPC1005X55N]
C706  2.2uF  [CAPC1005X55N]
C707  2.2uF  [CAPC1005X55N]
C708  680nF  [CAPC1005X55N]
C709  470nF  [CAPC1005X55N]
C710  4.7uF  [CAPC1005X55N]
C711  4.7uF  [CAPC1005X55N]
C712  2.2uF  [CAPC1005X55N]
C713  2.2uF  [CAPC1005X55N]
C714  680nF  [CAPC1005X55N]
C715  470nF  [CAPC1005X55N]
C716  10uF  [CAPC1608X80N]
C717  10uF  [CAPC1608X80N]
C718  10uF  [CAPC1608X80N]
C719  10uF  [CAPC1608X80N]
C720  10uF  [CAPC1608X80N]
C721  10uF  [CAPC1608X80N]
C722  10uF  [CAPC1608X80N]
C723  10uF  [CAPC1608X80N]
C724  10uF  [CAPC1608X80N]
C725  10uF  [CAPC1608X80N]
C726  10uF  [CAPC1608X80N]
C727  10uF  [CAPC1608X80N]
C728  4.7uF  [CAPC1005X55N]
C729  4.7uF  [CAPC1005X55N]
C730  2.2uF  [CAPC1005X55N]
C731  2.2uF  [CAPC1005X55N]
C732  680nF  [CAPC1005X55N]
C733  470nF  [CAPC1005X55N]

### Nets
ADC_AVCC: C690.2 C691.2 C692.2 C693.2 C694.2
ADC_AVCCAUX: C704.2 C705.2 C706.2 C707.2 C708.2 C709.2 C716.2 C717.2 C718.2 C719.2 C720.2 C721.2 C722.2 C723.2 C724.2 C725.2 C726.2 C727.2
DAC_AVCC: C696.2 C697.2 C698.2 C699.2 C700.2
DAC_AVCCAUX: C710.2 C711.2 C712.2 C713.2 C714.2 C715.2
DAC_AVTT: C728.2 C729.2 C730.2 C731.2 C732.2 C733.2
GND: C671.1 C672.1 C673.1 C674.1 C675.1 C676.1 C677.1 C678.1 C679.1 C680.1 C681.1 C682.1 C683.1 C684.1 C685.1 C686.1 C687.1 C688.1 C689.1 C690.1 C691.1 C692.1 C693.1 C694.1 C695.1 C696.1 C697.1 C698.1 C699.1 C700.1 C701.1 C702.1 C703.1 C704.1 C705.1 C706.1 C707.1 C708.1 C709.1 C710.1 C711.1 C712.1 C713.1 C714.1 C715.1 C716.1 C717.1 C718.1 C719.1 C720.1 C721.1 C722.1 C723.1 C724.1 C725.1 C726.1 C727.1 C728.1 C729.1 C730.1 C731.1 C732.1 C733.1
MGT1V2: C695.2
MGT1V8: C702.2 C703.2
MGTAVCC: C671.2 C672.2 C673.2 C674.2 C685.2 C686.2 C687.2 C688.2 C689.2
MGTRAVCC: C701.2
VCCINT_AMS: C675.2 C676.2 C677.2 C678.2 C679.2 C680.2 C681.2 C682.2 C683.2 C684.2

### Notes on the sheet
- VCCINT_AMS
- MGTAVCC
- (Infineon added 100uf, 47uf)
- (Infineon added 2x 47uf 3x 22uf, DNPs)
- ADC_AVCC
- MGTAVTT/VCCPSPLL
- DAC_AVCC
- MGTRAVCC
- ADC_AVCCAUX
- (Infineon added 12x 10uf)
- MGTVCCAUX/MGTRAVTT
- DAC_AVCCAUX
- DAC_AVTT
- Project/Equipment
- Document
- Designer
- Drawn by
- Check.by
- Copyright WUT ISE 2021
  This documentation describes Open Hardware and is licensed under CERN OHL v.1.1. You may redistribute and modify this documentaction under the terms of the CERN OHL v1.1.
  (http://ohwr.org/CERNOHL). This documentation is dristributed WITHOUT ANY EXPRESS OR IMPLIED WARRANTY, INCLUDING OF MERCHANTABLITY, SATISFACTORY QUALITY AND FITNESS FOR A PARTICULAR PURPOSE. Please see the CERN OHL v.1.1 for applicable conditions
- File
- Last Mod.
- Print Date
- Sheet
- Size
- A3
- of
- Rev
- Contact:

### Library data of the parts
C671-C673 C675 = CC1210_100UF_6.3V_20%_X5R: as C493 on sheet FPGA_7A35T_POWER; Part Number: CC1210_100UF_6.3V_20%_X5R; Component Kind: Standard; Component Type: Standard; Pin Count: 2; Value: 100uF; Status: Preferred; Manufacturer Part Number: CC1210_100UF_6.3V_20%_X5R; Case: 1210; Mounted: Yes; Socket: No; SMD: Yes; Sense: No; Manufacturer1 Example: MURATA; Manufacturer1 ComponentHeight: 2.7mm; HelpURL: \\cern.ch\dfs\Applications\Altium\Datasheets\CC1210_X5R_MURATA.pdf; Author: CERN DEM JLC; CreateDate: 19.04.2010; LatestRevisionDate: 19.04.2010
C674 C679-C682 C690 C691 C695-C697 C701-C705 C710 C711 C728 C729 = CC0402_4.7UF_6.3V_20%_X5R: as C565 on sheet FPGA_7A35T_POWER; Part Number: CC0402_4.7UF_6.3V_20%_X5R; Component Kind: Standard; Component Type: Standard; Pin Count: 2; Value: 4.7uF; Status: Preferred; Manufacturer Part Number: CC0402_4.7UF_6.3V_20%_X5R; Case: 0402; Mounted: Yes; Socket: No; SMD: Yes; Sense: No; Manufacturer1 Example: TDK; Manufacturer1 ComponentHeight: 0.65mm; HelpURL: \\cern.ch\dfs\Applications\Altium\Datasheets\CC0402_X5R_TDK_C.pdf; Author: CERN DEM JLC; CreateDate: 03.03.2015; LatestRevisionDate: 03.03.2015
C676 C685 C686 = CC0603_47UF_6.3V_20%_X5R: as C564 on sheet FPGA_7A35T_POWER; Part Number: CC0603_47UF_6.3V_20%_X5R; Component Kind: Standard; Component Type: Standard; Pin Count: 2; Value: 47uF; Status: None; Manufacturer Part Number: CC0603_47UF_6.3V_20%_X5R; Case: 0603; Mounted: Yes; Socket: No; SMD: Yes; Sense: No; Manufacturer1 Example: MURATA; Manufacturer1 ComponentHeight: 1mm; HelpURL: \\cern.ch\dfs\Applications\Altium\Datasheets\CC0603_MURATA_GRM188R60J476ME15D.pdf; Author: CERN DEM JLC; CreateDate: 01.02.2018; LatestRevisionDate: 01.02.2018
C677 C678 C716-C727 = CC0603_10UF_10V_10%_X5R: as C547 on sheet SoC_Decoupling; Part Number: CC0603_10UF_10V_10%_X5R; Component Kind: Standard; Component Type: Standard; Pin Count: 2; Value: 10uF; Status: None; Manufacturer Part Number: CC0603_10UF_10V_10%_X5R; Case: 0603; Mounted: Yes; Socket: No; SMD: Yes; Sense: No; Manufacturer1 Example: MURATA; Manufacturer1 ComponentHeight: 0.8mm; HelpURL: \\cern.ch\dfs\Applications\Altium\Datasheets\CC0603_MURATA_GRM188R61A106KE69D.pdf; Author: CERN DEM JLC; CreateDate: 31.01.2017; LatestRevisionDate: 31.01.2017
C683 C684 = CC0402_1UF_16V_10%_X5R: as C621-C632 on sheet SoC_Decoupling; Part Number: CC0402_1UF_16V_10%_X5R; Component Kind: Standard; Component Type: Standard; Pin Count: 2; Value: 1uF; Status: Preferred; Manufacturer Part Number: CC0402_1UF_16V_10%_X5R; Case: 0402; Mounted: Yes; Socket: No; SMD: Yes; Sense: No; Manufacturer1 Example: TDK; Manufacturer1 ComponentHeight: 0.55mm; HelpURL: \\cern.ch\dfs\Applications\Altium\Datasheets\CC0402_X5R_TDK_C.pdf; Author: CERN DEM JLC; CreateDate: 25.10.2012; LatestRevisionDate: 25.10.2012
C687-C689 = CC1210_22UF_25V_10%_X5R: Non-polarised capacitor; Part Description: SMD Multilayer Chip Ceramic Capacitor; Manufacturer: GENERIC; Manufacturer1 Part Number: 12103D226KAT2A; Voltage: 25V; Tolerance: ±10%; TC: X5R; Part Number: CC1210_22UF_25V_10%_X5R; Component Kind: Standard; Component Type: Standard; Pin Count: 2; Value: 22uF; Status: Preferred; Manufacturer Part Number: CC1210_22UF_25V_10%_X5R; Case: 1210; Mounted: Yes; Socket: No; SMD: Yes; Sense: No; Manufacturer1 Example: AVX; Manufacturer1 ComponentHeight: 2.79mm; HelpURL: \\cern.ch\dfs\Applications\Altium\Datasheets\CC1210_X5R_AVX.pdf; Author: CERN DEM JLC; CreateDate: 12.11.2014; LatestRevisionDate: 12.11.2014
C692-C694 C698-C700 C706 C707 C712 C713 C730 C731 = CC0402_2.2UF_6.3V_10%_X5R: Non-polarised capacitor; Part Description: SMD Multilayer Chip Ceramic Capacitor; Manufacturer: GENERIC; Manufacturer1 Part Number: C1005X5R0J225K050BC; Voltage: 6.3V; Tolerance: ±10%; TC: X5R; Part Number: CC0402_2.2UF_6.3V_10%_X5R; Component Kind: Standard; Component Type: Standard; Pin Count: 2; Value: 2.2uF; Status: Preferred; Manufacturer Part Number: CC0402_2.2UF_6.3V_10%_X5R; Case: 0402; Mounted: Yes; Socket: No; SMD: Yes; Sense: No; Manufacturer1 Example: TDK; Manufacturer1 ComponentHeight: 0.55mm; HelpURL: \\cern.ch\dfs\Applications\Altium\Datasheets\CC0402_X5R_TDK_C.pdf; Author: CERN DEM JMW; CreateDate: 22.09.2015; LatestRevisionDate: 22.09.2015
C708 C714 C732 = CC0402_680NF_10V_10%_X5R: Non-polarised capacitor; Part Description: SMD Multilayer Chip Ceramic Capacitor; Manufacturer: GENERIC; Manufacturer1 Part Number: GRM155R61A684KE15; Voltage: 10V; TC: X5R; Tolerance: ±10%; Part Number: CC0402_680NF_10V_10%_X5R; Component Kind: Standard; Component Type: Standard; Pin Count: 2; Value: 680nF; Status: None; Manufacturer Part Number: CC0402_680NF_10V_10%_X5R; Case: 0402; Mounted: Yes; Socket: No; SMD: Yes; Sense: No; Manufacturer1 Example: MURATA; Manufacturer1 ComponentHeight: 0.55mm; HelpURL: \\cern.ch\dfs\Applications\Altium\Datasheets\CC0402_X5R_MURATA_GRM.pdf; Author: CERN DEM BC; CreateDate: 19.04.2021; LatestRevisionDate: 19.04.2021
C709 C715 C733 = CC0402_470NF_6.3V_10%_X5R: Non-polarised capacitor; Part Description: SMD Multilayer Chip Ceramic Capacitor; Manufacturer: GENERIC; Manufacturer1 Part Number: GRM155R60J474KE19D; Voltage: 6.3V; Tolerance: ±10%; TC: X5R; Part Number: CC0402_470NF_6.3V_10%_X5R; Component Kind: Standard; Component Type: Standard; Pin Count: 2; Value: 470nF; Status: Preferred; Manufacturer Part Number: CC0402_470NF_6.3V_10%_X5R; Case: 0402; Mounted: Yes; Socket: No; SMD: Yes; Sense: No; Manufacturer1 Example: MURATA; Manufacturer1 ComponentHeight: 0.55mm; HelpURL: \\cern.ch\dfs\Applications\Altium\Datasheets\CC0402_X5R_MURATA_GRM.pdf; Author: CERN DEM JLC; CreateDate: 22.04.2010; LatestRevisionDate: 22.04.2010

## Sheet SoC_Supply_GND.SchDoc: RFSoC AMC
size 420 x 297 mm; CompanyName: WUT; DrawnBy: T. Przywozki; Organization: WUT ISE; Address1: Warsaw University of Technology; Address2: Nowowiejska 15/19 00-665 Warsaw; Address3: Tomasz.Przywozki@pw.edu.pl; DocumentNumber: 13; Revision: 1; SheetNumber: 13; SheetTotal: 45; Project: RFSoC AMC; ModifiedBy: T. Przywozki; CreateDate: -; CheckedDate: -; DivGrp: ISE; Designer: T. Przywozki; ModifiedDate: -; ProjectName: ADC/DAC MEZZANINE
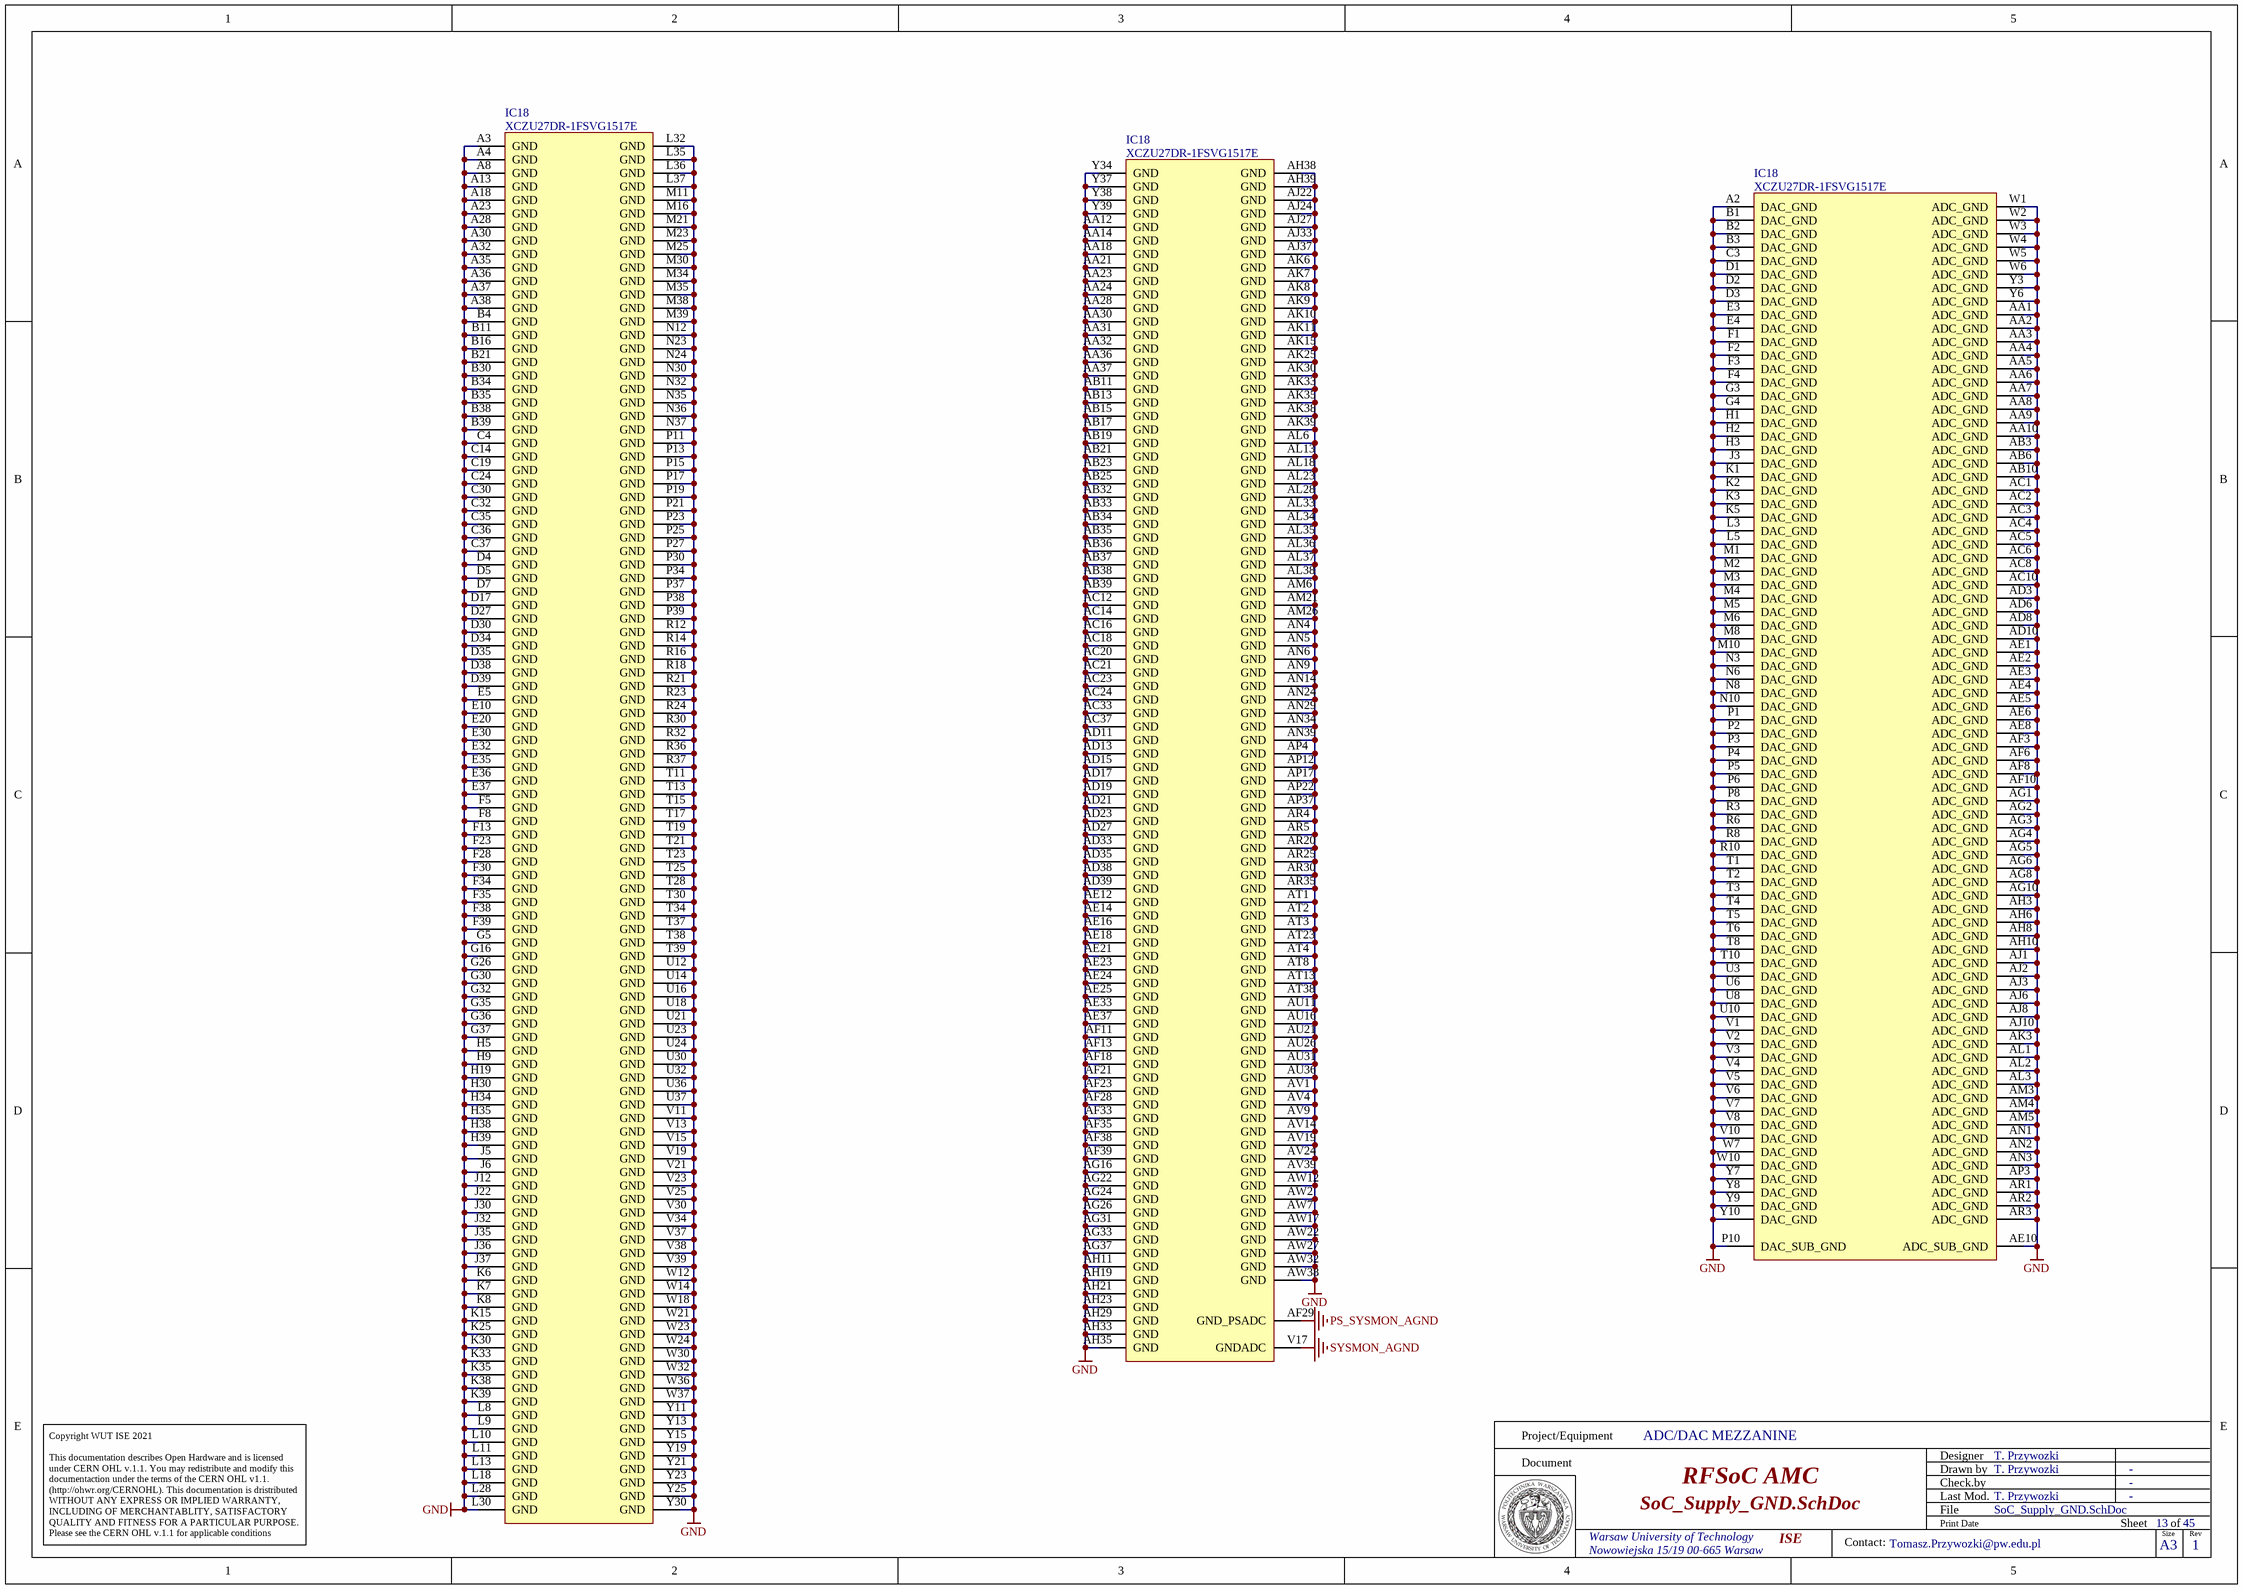
[diagram p46: SoC_Supply_GND.SchDoc]

### Parts
IC18  XCZU27DR-1FSVG1517E  [XILINX_FSVG1517 (XCZU27DR)]  (parts 29,30,31 of 31)

### Nets
GND: IC18.A2(DAC_GND) IC18.A3(GND) IC18.A4(GND) IC18.A8(GND) IC18.A13(GND) IC18.A18(GND) IC18.A23(GND) IC18.A28(GND) IC18.A30(GND) IC18.A32(GND) IC18.A35(GND) IC18.A36(GND) IC18.A37(GND) IC18.A38(GND) IC18.AA1(ADC_GND) IC18.AA2(ADC_GND) IC18.AA3(ADC_GND) IC18.AA4(ADC_GND) IC18.AA5(ADC_GND) IC18.AA6(ADC_GND) IC18.AA7(ADC_GND) IC18.AA8(ADC_GND) IC18.AA9(ADC_GND) IC18.AA10(ADC_GND) IC18.AA12(GND) IC18.AA14(GND) IC18.AA18(GND) IC18.AA21(GND) IC18.AA23(GND) IC18.AA24(GND) IC18.AA28(GND) IC18.AA30(GND) IC18.AA31(GND) IC18.AA32(GND) IC18.AA36(GND) IC18.AA37(GND) IC18.AB3(ADC_GND) IC18.AB6(ADC_GND) IC18.AB10(ADC_GND) IC18.AB11(GND) IC18.AB13(GND) IC18.AB15(GND) IC18.AB17(GND) IC18.AB19(GND) IC18.AB21(GND) IC18.AB23(GND) IC18.AB25(GND) IC18.AB32(GND) IC18.AB33(GND) IC18.AB34(GND) IC18.AB35(GND) IC18.AB36(GND) IC18.AB37(GND) IC18.AB38(GND) IC18.AB39(GND) IC18.AC1(ADC_GND) IC18.AC2(ADC_GND) IC18.AC3(ADC_GND) IC18.AC4(ADC_GND) IC18.AC5(ADC_GND) IC18.AC6(ADC_GND) IC18.AC8(ADC_GND) IC18.AC10(ADC_GND) IC18.AC12(GND) IC18.AC14(GND) IC18.AC16(GND) IC18.AC18(GND) IC18.AC20(GND) IC18.AC21(GND) IC18.AC23(GND) IC18.AC24(GND) IC18.AC33(GND) IC18.AC37(GND) IC18.AD3(ADC_GND) IC18.AD6(ADC_GND) IC18.AD8(ADC_GND) IC18.AD10(ADC_GND) IC18.AD11(GND) IC18.AD13(GND) IC18.AD15(GND) IC18.AD17(GND) IC18.AD19(GND) IC18.AD21(GND) IC18.AD23(GND) IC18.AD27(GND) IC18.AD33(GND) IC18.AD35(GND) IC18.AD38(GND) IC18.AD39(GND) IC18.AE1(ADC_GND) IC18.AE2(ADC_GND) IC18.AE3(ADC_GND) IC18.AE4(ADC_GND) IC18.AE5(ADC_GND) IC18.AE6(ADC_GND) IC18.AE8(ADC_GND) IC18.AE10(ADC_SUB_GND) IC18.AE12(GND) IC18.AE14(GND) IC18.AE16(GND) IC18.AE18(GND) IC18.AE21(GND) IC18.AE23(GND) IC18.AE24(GND) IC18.AE25(GND) IC18.AE33(GND) IC18.AE37(GND) IC18.AF3(ADC_GND) IC18.AF6(ADC_GND) IC18.AF8(ADC_GND) IC18.AF10(ADC_GND) IC18.AF11(GND) IC18.AF13(GND) IC18.AF18(GND) IC18.AF21(GND) IC18.AF23(GND) IC18.AF28(GND) IC18.AF33(GND) IC18.AF35(GND) IC18.AF38(GND) IC18.AF39(GND) IC18.AG1(ADC_GND) IC18.AG2(ADC_GND) IC18.AG3(ADC_GND) IC18.AG4(ADC_GND) IC18.AG5(ADC_GND) IC18.AG6(ADC_GND) IC18.AG8(ADC_GND) IC18.AG10(ADC_GND) IC18.AG16(GND) IC18.AG22(GND) IC18.AG24(GND) IC18.AG26(GND) IC18.AG31(GND) IC18.AG33(GND) IC18.AG37(GND) IC18.AH3(ADC_GND) IC18.AH6(ADC_GND) IC18.AH8(ADC_GND) IC18.AH10(ADC_GND) IC18.AH11(GND) IC18.AH19(GND) IC18.AH21(GND) IC18.AH23(GND) IC18.AH29(GND) IC18.AH33(GND) IC18.AH35(GND) IC18.AH38(GND) IC18.AH39(GND) IC18.AJ1(ADC_GND) IC18.AJ2(ADC_GND) IC18.AJ3(ADC_GND) IC18.AJ6(ADC_GND) IC18.AJ8(ADC_GND) IC18.AJ10(ADC_GND) IC18.AJ22(GND) IC18.AJ24(GND) IC18.AJ27(GND) IC18.AJ33(GND) IC18.AJ37(GND) IC18.AK3(ADC_GND) IC18.AK6(GND) IC18.AK7(GND) IC18.AK8(GND) IC18.AK9(GND) IC18.AK10(GND) IC18.AK11(GND) IC18.AK15(GND) IC18.AK25(GND) IC18.AK30(GND) IC18.AK33(GND) IC18.AK35(GND) IC18.AK38(GND) IC18.AK39(GND) IC18.AL1(ADC_GND) IC18.AL2(ADC_GND) IC18.AL3(ADC_GND) IC18.AL6(GND) IC18.AL13(GND) IC18.AL18(GND) IC18.AL23(GND) IC18.AL28(GND) IC18.AL33(GND) IC18.AL34(GND) IC18.AL35(GND) IC18.AL36(GND) IC18.AL37(GND) IC18.AL38(GND) IC18.AM3(ADC_GND) IC18.AM4(ADC_GND) IC18.AM5(ADC_GND) IC18.AM6(GND) IC18.AM21(GND) IC18.AM26(GND) IC18.AN1(ADC_GND) IC18.AN2(ADC_GND) IC18.AN3(ADC_GND) IC18.AN4(GND) IC18.AN5(GND) IC18.AN6(GND) IC18.AN9(GND) IC18.AN14(GND) IC18.AN24(GND) IC18.AN29(GND) IC18.AN34(GND) IC18.AN39(GND) IC18.AP3(ADC_GND) IC18.AP4(GND) IC18.AP12(GND) IC18.AP17(GND) IC18.AP22(GND) IC18.AP37(GND) IC18.AR1(ADC_GND) IC18.AR2(ADC_GND) IC18.AR3(ADC_GND) IC18.AR4(GND) IC18.AR5(GND) IC18.AR20(GND) IC18.AR25(GND) IC18.AR30(GND) IC18.AR35(GND) IC18.AT1(GND) IC18.AT2(GND) IC18.AT3(GND) IC18.AT4(GND) IC18.AT8(GND) IC18.AT13(GND) IC18.AT23(GND) IC18.AT38(GND) IC18.AU11(GND) IC18.AU16(GND) IC18.AU21(GND) IC18.AU26(GND) IC18.AU31(GND) IC18.AU36(GND) IC18.AV1(GND) IC18.AV4(GND) IC18.AV9(GND) IC18.AV14(GND) IC18.AV19(GND) IC18.AV24(GND) IC18.AV39(GND) IC18.AW2(GND) IC18.AW7(GND) IC18.AW12(GND) IC18.AW17(GND) IC18.AW22(GND) IC18.AW27(GND) IC18.AW32(GND) IC18.AW38(GND) IC18.B1(DAC_GND) IC18.B2(DAC_GND) IC18.B3(DAC_GND) IC18.B4(GND) IC18.B11(GND) IC18.B16(GND) IC18.B21(GND) IC18.B30(GND) IC18.B34(GND) IC18.B35(GND) IC18.B38(GND) IC18.B39(GND) IC18.C3(DAC_GND) IC18.C4(GND) IC18.C14(GND) IC18.C19(GND) IC18.C24(GND) IC18.C30(GND) IC18.C32(GND) IC18.C35(GND) IC18.C36(GND) IC18.C37(GND) IC18.D1(DAC_GND) IC18.D2(DAC_GND) IC18.D3(DAC_GND) IC18.D4(GND) IC18.D5(GND) IC18.D7(GND) IC18.D17(GND) IC18.D27(GND) IC18.D30(GND) IC18.D34(GND) IC18.D35(GND) IC18.D38(GND) IC18.D39(GND) IC18.E3(DAC_GND) IC18.E4(DAC_GND) IC18.E5(GND) IC18.E10(GND) IC18.E20(GND) IC18.E30(GND) IC18.E32(GND) IC18.E35(GND) IC18.E36(GND) IC18.E37(GND) IC18.F1(DAC_GND) IC18.F2(DAC_GND) IC18.F3(DAC_GND) IC18.F4(DAC_GND) IC18.F5(GND) IC18.F8(GND) IC18.F13(GND) IC18.F23(GND) IC18.F28(GND) IC18.F30(GND) IC18.F34(GND) IC18.F35(GND) IC18.F38(GND) IC18.F39(GND) IC18.G3(DAC_GND) IC18.G4(DAC_GND) IC18.G5(GND) IC18.G16(GND) IC18.G26(GND) IC18.G30(GND) IC18.G32(GND) IC18.G35(GND) IC18.G36(GND) IC18.G37(GND) IC18.H1(DAC_GND) IC18.H2(DAC_GND) IC18.H3(DAC_GND) IC18.H5(GND) IC18.H9(GND) IC18.H19(GND) IC18.H30(GND) IC18.H34(GND) IC18.H35(GND) IC18.H38(GND) IC18.H39(GND) IC18.J3(DAC_GND) IC18.J5(GND) IC18.J6(GND) IC18.J12(GND) IC18.J22(GND) IC18.J30(GND) IC18.J32(GND) IC18.J35(GND) IC18.J36(GND) IC18.J37(GND) IC18.K1(DAC_GND) IC18.K2(DAC_GND) IC18.K3(DAC_GND) IC18.K5(DAC_GND) IC18.K6(GND) IC18.K7(GND) IC18.K8(GND) IC18.K15(GND) IC18.K25(GND) IC18.K30(GND) IC18.K33(GND) IC18.K35(GND) IC18.K38(GND) IC18.K39(GND) IC18.L3(DAC_GND) IC18.L5(DAC_GND) IC18.L8(GND) IC18.L9(GND) IC18.L10(GND) IC18.L11(GND) IC18.L13(GND) IC18.L18(GND) IC18.L28(GND) IC18.L30(GND) IC18.L32(GND) IC18.L35(GND) IC18.L36(GND) IC18.L37(GND) IC18.M1(DAC_GND) IC18.M2(DAC_GND) IC18.M3(DAC_GND) IC18.M4(DAC_GND) IC18.M5(DAC_GND) IC18.M6(DAC_GND) IC18.M8(DAC_GND) IC18.M10(DAC_GND) IC18.M11(GND) IC18.M16(GND) IC18.M21(GND) IC18.M23(GND) IC18.M25(GND) IC18.M30(GND) IC18.M34(GND) IC18.M35(GND) IC18.M38(GND) IC18.M39(GND) IC18.N3(DAC_GND) IC18.N6(DAC_GND) IC18.N8(DAC_GND) IC18.N10(DAC_GND) IC18.N12(GND) IC18.N23(GND) IC18.N24(GND) IC18.N30(GND) IC18.N32(GND) IC18.N35(GND) IC18.N36(GND) IC18.N37(GND) IC18.P1(DAC_GND) IC18.P2(DAC_GND) IC18.P3(DAC_GND) IC18.P4(DAC_GND) IC18.P5(DAC_GND) IC18.P6(DAC_GND) IC18.P8(DAC_GND) IC18.P10(DAC_SUB_GND) IC18.P11(GND) IC18.P13(GND) IC18.P15(GND) IC18.P17(GND) IC18.P19(GND) IC18.P21(GND) IC18.P23(GND) IC18.P25(GND) IC18.P27(GND) IC18.P30(GND) IC18.P34(GND) IC18.P37(GND) IC18.P38(GND) IC18.P39(GND) IC18.R3(DAC_GND) IC18.R6(DAC_GND) IC18.R8(DAC_GND) IC18.R10(DAC_GND) IC18.R12(GND) IC18.R14(GND) IC18.R16(GND) IC18.R18(GND) IC18.R21(GND) IC18.R23(GND) IC18.R24(GND) IC18.R30(GND) IC18.R32(GND) IC18.R36(GND) IC18.R37(GND) IC18.T1(DAC_GND) IC18.T2(DAC_GND) IC18.T3(DAC_GND) IC18.T4(DAC_GND) IC18.T5(DAC_GND) IC18.T6(DAC_GND) IC18.T8(DAC_GND) IC18.T10(DAC_GND) IC18.T11(GND) IC18.T13(GND) IC18.T15(GND) IC18.T17(GND) IC18.T19(GND) IC18.T21(GND) IC18.T23(GND) IC18.T25(GND) IC18.T28(GND) IC18.T30(GND) IC18.T34(GND) IC18.T37(GND) IC18.T38(GND) IC18.T39(GND) IC18.U3(DAC_GND) IC18.U6(DAC_GND) IC18.U8(DAC_GND) IC18.U10(DAC_GND) IC18.U12(GND) IC18.U14(GND) IC18.U16(GND) IC18.U18(GND) IC18.U21(GND) IC18.U23(GND) IC18.U24(GND) IC18.U30(GND) IC18.U32(GND) IC18.U36(GND) IC18.U37(GND) IC18.V1(DAC_GND) IC18.V2(DAC_GND) IC18.V3(DAC_GND) IC18.V4(DAC_GND) IC18.V5(DAC_GND) IC18.V6(DAC_GND) IC18.V7(DAC_GND) IC18.V8(DAC_GND) IC18.V10(DAC_GND) IC18.V11(GND) IC18.V13(GND) IC18.V15(GND) IC18.V19(GND) IC18.V21(GND) IC18.V23(GND) IC18.V25(GND) IC18.V30(GND) IC18.V34(GND) IC18.V37(GND) IC18.V38(GND) IC18.V39(GND) IC18.W1(ADC_GND) IC18.W2(ADC_GND) IC18.W3(ADC_GND) IC18.W4(ADC_GND) IC18.W5(ADC_GND) IC18.W6(ADC_GND) IC18.W7(DAC_GND) IC18.W10(DAC_GND) IC18.W12(GND) IC18.W14(GND) IC18.W18(GND) IC18.W21(GND) IC18.W23(GND) IC18.W24(GND) IC18.W30(GND) IC18.W32(GND) IC18.W36(GND) IC18.W37(GND) IC18.Y3(ADC_GND) IC18.Y6(ADC_GND) IC18.Y7(DAC_GND) IC18.Y8(DAC_GND) IC18.Y9(DAC_GND) IC18.Y10(DAC_GND) IC18.Y11(GND) IC18.Y13(GND) IC18.Y15(GND) IC18.Y19(GND) IC18.Y21(GND) IC18.Y23(GND) IC18.Y25(GND) IC18.Y30(GND) IC18.Y34(GND) IC18.Y37(GND) IC18.Y38(GND) IC18.Y39(GND)
PS_SYSMON_AGND: IC18.AF29(GND_PSADC)  [project net PSADC_GND]
SYSMON_AGND: IC18.V17(GNDADC)

### Notes on the sheet
- Project/Equipment
- Document
- Designer
- Drawn by
- Check.by
- Copyright WUT ISE 2021
  This documentation describes Open Hardware and is licensed under CERN OHL v.1.1. You may redistribute and modify this documentaction under the terms of the CERN OHL v1.1.
  (http://ohwr.org/CERNOHL). This documentation is dristributed WITHOUT ANY EXPRESS OR IMPLIED WARRANTY, INCLUDING OF MERCHANTABLITY, SATISFACTORY QUALITY AND FITNESS FOR A PARTICULAR PURPOSE. Please see the CERN OHL v.1.1 for applicable conditions
- File
- Last Mod.
- Print Date
- Sheet
- Size
- A3
- of
- Rev
- Contact:

### Library data of the parts
IC18 = XCZU27DR-1FSVG1517E: Zynq UltraScale+ RFSoC, Quad-Core ARM® Cortex™-A53 MPCore™ up to 1.5GHz, 214 PS I/O, 299 HP I/O, 48 HD I/O, 1517-Pin BGA; Manufacturer: XILINX; PressFit: No; Bonding: No; Part Number: XCZU27DR-1FSVG1517E; Component Kind: Standard; Component Type: Standard; Device: XCZU27DR-1FSVG1517E; PackageDescription: BGA, 1.00mm Pitch, Square; 1517 Pin, 39 Columns X 39 Rows, 40.00mm X 40.00mm X 4.01mm H; Part Description: Zynq UltraScale+ RFSoC, Quad-Core ARM® Cortex™-A53 MPCore™ up to 1.5GHz, 214 PS I/O, 299 HP I/O, 48 HD I/O, 1517-Pin BGA; Manufacturer Part Number: XCZU27DR-1FSVG1517E; Pin Count: 1517; Case: BGA1517; Mounted: Yes; Socket: No; SMD: Yes; Sense: No; ComponentHeight: 4.01mm; HelpURL: \\cern.ch\dfs\Applications\Altium\Datasheets\XCZU27DR-1FSVG1517E.pdf; ComponentLink1URL: \\cern.ch\dfs\Applications\Altium\Datasheets\XCZU27DR-1FSVG1517E_Package-Pinout.pdf; ComponentLink1Description: Package/Pinout; ComponentLink2URL: \\cern.ch\dfs\Applications\Altium\Datasheets\XCZU27DR-1FSVG1517E_Pinout.pdf; ComponentLink2Description: Pinout; Author: CERN DEM MR; CreateDate: 02/05/2018; LatestRevisionDate: 02/05/2018